# Altium schematic sheet I2C_Shield.SchDoc
size A4; Address1: Atakan
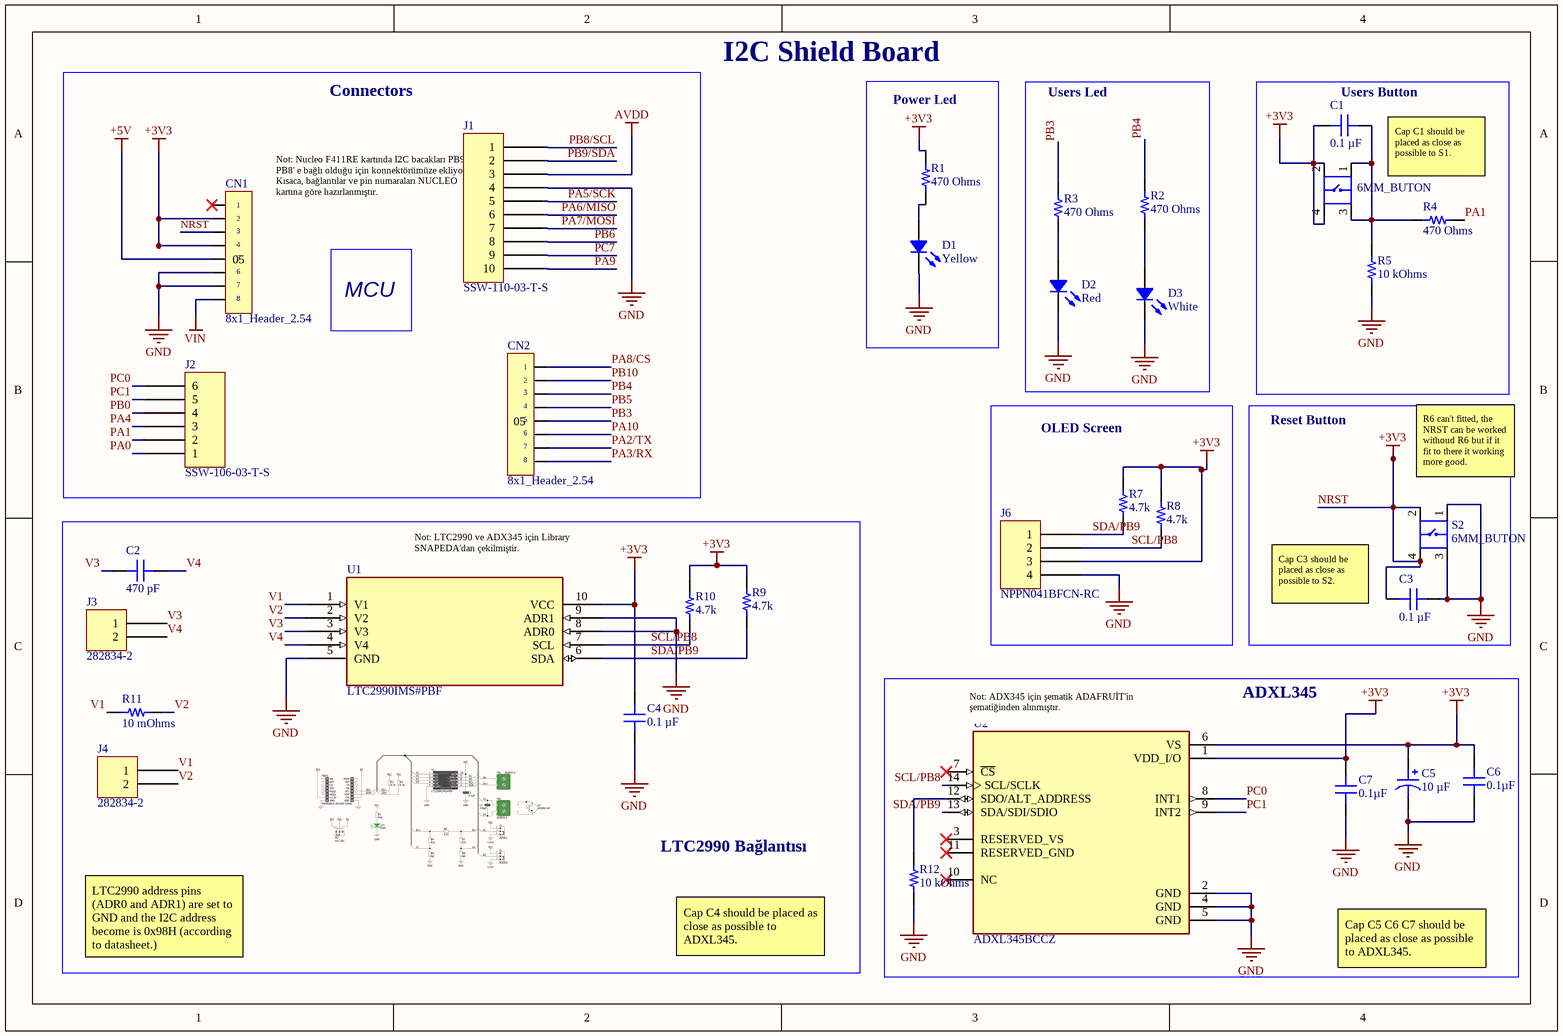
[diagram p0: I2C_Shield.SchDoc]

## Parts
C1  0.1 µF  [CAP 0805_2012]
C2  470 pF  [CAP 0805_2012]
C3  0.1 µF  [CAP 0805_2012]
C4  0.1 µF  [CAP 0805_2012]
C5  10 µF  [CAP POL 1206_3216]
C6  0.1µF  [CAP 0805_2012]
C7  0.1µF  [CAP 0805_2012]
CN1  8x1_Header_2.54  [8X1_HEADER]
CN2  8x1_Header_2.54  [8X1_HEADER]
D1  Yellow  [LED 0805_2012 YELLOW]
D2  Red  [LED 0805_2012 RED]
D3  White  [LED 0805_2012]
J1  SSW-110-03-T-S  [SAMTEC SSW-110-03-T-S]
J2  SSW-106-03-T-S  [SAMTEC SSW-106-03-T-S]
J3  282834-2  [TE 282834-2]
J4  282834-2  [TE 282834-2]
J6  NPPN041BFCN-RC  [SULLINS NPPN041BFCN]
R1  470 Ohms  [YAGEO RES RK73 RS73 SG73 0805_2012]
R2  470 Ohms  [YAGEO RES RK73 RS73 SG73 0805_2012]
R3  470 Ohms  [YAGEO RES RK73 RS73 SG73 0805_2012]
R4  470 Ohms  [YAGEO RES RK73 RS73 SG73 0805_2012]
R5  10 kOhms  [RES 0805_2012]
R7  4.7k  [RES 0805_2012]
R8  4.7k  [RES 0805_2012]
R9  4.7k  [RES 0805_2012]
R10  4.7k  [RES 0805_2012]
R11  10 mOhms  [RES 0805_2012]
R12  10 kOhms  [RES 0805_2012]
S1  6MM_BUTON  [6MMTACTILESWITCH]
S2  6MM_BUTON  [6MMTACTILESWITCH]
U1  LTC2990IMS#PBF  [MSOP-10_MS]
U2  ADXL345BCCZ  [IC_ADXL345BCCZ]

## Blocks framed on the sheet
MCU: CN1 CN2 J1 J2
Power Led: D1 R1
Users Led: D2 D3 R2 R3
Users Button: C1 R4 R5 S1
OLED Screen: J6 R7 R8
Reset Button: C3 S2
LTC2990 Bağlantısı: C2 C4 J3 J4 R9-R11 U1
ADXL345: C5-C7 R12 U2

## Nets
+5V: CN1.05
AVDD: J1.3
GND: C3.2 C4.2 C5.2 C6.2 C7.2 CN1.06 CN1.07 D1.2 D2.2 D3.2 J1.4 J6.4 R5.2 R12.2 S2.1 S2.3 U1.5(GND) U1.8(ADR0) U1.9(ADR1) U2.2(GND) U2.4(GND) U2.5(GND)
NRST: C1.1 C3.1 C4.1 C5.1 C6.1 C7.1 CN1.02 CN1.03 CN1.04 J6.3 R1.1 R7.1 R8.1 R9.1 R10.1 S1.2 S1.4 S2.2 S2.4 U1.10(VCC) U2.1(VDD_I/O) U2.6(VS)  [also labelled +3V3]
VIN: CN1.08
PA0: J2.1
PA1: J2.2 R4.1
PA2/TX: CN2.07
PA3/RX: CN2.08
PA4: J2.3
PA5/SCK: J1.5
PA6/MISO: J1.6
PA7/MOSI: J1.7
PA8/CS: CN2.01
PA9: J1.10
PA10: CN2.06
PB0: J2.4
PB3: CN2.05 R3.1
PB4: CN2.03 R2.1
PB5: CN2.04
PB6: J1.8
PB8/SCL: J1.1
PB9/SDA: J1.2
PB10: CN2.02
PC0: J2.6 U2.8(INT1)
PC1: J2.5 U2.9(INT2)
PC7: J1.9
SCL/PB8: J6.2 R8.2 R10.2 U1.7(SCL) U2.14(SCL/SCLK)
SDA/PB9: J6.1 R7.2 R9.2 U1.6(SDA) U2.13(SDA/SDI/SDIO)
V1: J4.1 R11.1 U1.1(V1)
V2: J4.2 R11.2 U1.2(V2)
V3: C2.1 J3.1 U1.3(V3)
V4: C2.2 J3.2 U1.4(V4)
NetC1_2: C1.2 R4.2 R5.1 S1.1 S1.3
NetD1_1: D1.1 R1.2
NetD2_1: D2.1 R3.2
NetD3_1: D3.1 R2.2
NetR12_1: R12.1 U2.12(SDO/ALT_ADDRESS)

Not connected (* = marked no-connect by the designer): CN1 01*; U2 3(RESERVED_VS)* 7(~{CS})* 10(NC)* 11(RESERVED_GND)*

## Notes on the sheet
- Connectors
- I2C Shield Board
- Cap C1 should be placed as close as possible to S1.
- (near J1) Not: Nucleo F411RE kartında I2C bacakları PB9 ve PB8' e bağlı olduğu için konnektörümüze ekliyoruz. Kısaca, bağlantılar ve pin numaraları NUCLEO kartına göre hazırlanmıştır.
- (near S2) R6 can't fitted, the NRST can be worked withoud R6 but if it fit to there it working more good.
- (near U1) Not: LTC2990 ve ADX345 için Library SNAPEDA'dan çekilmiştir.
- (near C3) Cap C3 should be placed as close as possible to S2.
- (near U2) Not: ADX345 için şematik ADAFRUİT'in şematiğinden alınmıştır.
- LTC2990 address pins (ADR0 and ADR1) are set to GND and the I2C address become is 0x98H (according to datasheet.)
- Cap C4 should be placed as close as possible to ADXL345.
- Cap C5 C6 C7 should be placed as close as possible to ADXL345.
- Title
- Size:
- Date:
- A4
- Number:
- Time:
- Revision:
- Sheet
- of
- File:
- (in symbol 8x1_Header_2.54) 1; 2; 3; 4; 5; 6; 7; 8

## Library data of the parts
C1 C3 = 0805B104K160CT: CAP CER 0.1UF 16V X7R 0805; manufacturer: Walsin Technology Corporation; Tolerance: ±10%; Part Number: 0805B104K160CT; Applications: General Purpose; componentlink1description: Datasheet; componentlink1url: http://www.passivecomponent.com/wp-content/uploads/2018/10/MLCC.pdf; componentlink2description: DigiKey Link; componentlink2url: https://www.digikey.com/en/products/detail/walsin-technology-corporation/0805B104K160CT/9355062; Device Package: 0805 (2012 Metric); lastupdated: 9.02.2024 20:16:02; Lifecycle Status: Active; Minimum Order: 1; Mounting Type: Surface Mount, MLCC; Operating Temperature: -55°C ~ 125°C; Package / Case: 0805 (2012 Metric); packaging: TapeAndReel; partid: 4882; Part Status: Active; price: 0.01; series: -; Size / Dimension: 0.079" L x 0.049" W (2.00mm x 1.25mm); Supplier 1: DigiKey; Supplier Part Number 1: 1292-1565-1-ND; Temperature Coefficient: X7R; Thickness (Max): 0.035" (0.90mm); value: 0.1 µF; Voltage - Rated: 16V
  C1: Capacitance: 0.1 µF
C2 = 885012207006: CAP CER 470PF 10V X7R 0805; manufacturer: Würth Elektronik; Tolerance: ±10%; Part Number: 885012207006; Capacitance: 470 pF; Applications: General Purpose; componentlink1description: Datasheet; componentlink1url: https://katalog.we-online.de/pbs/datasheet/885012207006.pdf; componentlink2description: DigiKey Link; componentlink2url: https://www.digikey.com/en/products/detail/würth-elektronik/885012207006/5453871; Device Package: 0805 (2012 Metric); lastupdated: 9.02.2024 20:15:30; Lifecycle Status: Active; Minimum Order: 1; Mounting Type: Surface Mount, MLCC; Operating Temperature: -55°C ~ 125°C; Package / Case: 0805 (2012 Metric); packaging: TapeAndReel; partid: 42624; Part Status: Active; price: 0.03; series: WCAP-CSGP; Size / Dimension: 0.079" L x 0.049" W (2.00mm x 1.25mm); Supplier 1: DigiKey; Supplier Part Number 1: 732-8016-1-ND; Temperature Coefficient: X7R; Thickness (Max): 0.035" (0.90mm); value: 470 pF; Voltage - Rated: 10V
C4 = LMK212SD104KG-T: CAP CER 0.1UF 10V 0805; manufacturer: Taiyo Yuden; Tolerance: ±10%; Part Number: LMK212SD104KG-T; Capacitance: 0.1 µF; Applications: General Purpose; componentlink1description: Datasheet; componentlink1url: http://www.yuden.co.jp/productdata/catalog/mlcc07_e.pdf; componentlink2description: DigiKey Link; componentlink2url: https://www.digikey.com/en/products/detail/taiyo-yuden/LMK212SD104KG-T/930486; Device Package: 0805 (2012 Metric); Features: Low Distortion; lastupdated: 9.02.2024 20:15:36; Lifecycle Status: Active; Minimum Order: 1; Mounting Type: Surface Mount, MLCC; Operating Temperature: -55°C ~ 125°C; Package / Case: 0805 (2012 Metric); packaging: TapeAndReel; partid: 14462; Part Status: Active; price: 0.06; series: CFCAP™; Size / Dimension: 0.079" L x 0.049" W (2.00mm x 1.25mm); Supplier 1: DigiKey; Supplier Part Number 1: 587-1134-1-ND; Thickness (Max): 0.053" (1.35mm); value: 0.1 µF; Voltage - Rated: 10V
C5 = 593D106X9010A2TE3: CAP TANT 10UF 10% 10V 1206; manufacturer: Vishay Sprague; Manufacturer Size Code: A; ESR (Equivalent Series Resistance): 2Ohm; Type: Molded; Part Number: 593D106X9010A2TE3; Value: 10 µF; Capacitance: 10 µF; componentlink1description: Datasheet; componentlink1url: http://www.vishay.com/docs/40005/593d.pdf; componentlink2description: DigiKey Link; componentlink2url: https://www.digikey.com/en/products/detail/vishay-sprague/593D106X9010A2TE3/1579064; Device Package: 1206 (3216 Metric); Features: General Purpose; Height - Seated (Max): 0.071" (1.80mm); lastupdated: 3.06.2024 19:29:35; Lifecycle Status: Active; Minimum Order: 1; Mounting Type: Surface Mount; Operating Temperature: -55°C ~ 125°C; Package / Case: 1206 (3216 Metric); packaging: TapeAndReel; partid: 896; Part Status: Active; price: 0.09; series: TANTAMOUNT™, 593D; Size / Dimension: 0.126" L x 0.063" W (3.20mm x 1.60mm); Supplier 1: DigiKey; Supplier Part Number 1: 718-1969-1-ND; Tolerance: ±10%; Voltage - Rated: 10 V
C6 C7 = 08053C104JAT4A: CAP CER 0.1UF 25V X7R 0805; manufacturer: AVX Corporation; Tolerance: ±5%; Part Number: 08053C104JAT4A; Capacitance: 0.1µF; Applications: General Purpose; componentlink1description: Datasheet; componentlink1url: http://datasheets.avx.com/X7RDielectric.pdf; componentlink2description: DigiKey Link; componentlink2url: http://digikey.com/product-detail/en/avx-corporation/08053C104JAT4A/478-13051-1-ND/9948569; Device Package: 0805 (2012 Metric); lastupdated: 2.09.2020 01:04:39; Lifecycle Status: Active; Minimum Order: 1; Mounting Type: Surface Mount, MLCC; Operating Temperature: -55°C ~ 125°C; Package / Case: 0805 (2012 Metric); packaging: TapeAndReel; partid: 3721; Part Status: Active; price: 0.04; series: -; Size / Dimension: 0.079" L x 0.049" W (2.01mm x 1.25mm); Supplier 1: DigiKey; Supplier Part Number 1: 478-13051-1-ND; Temperature Coefficient: X7R; Thickness (Max): 0.037" (0.94mm); value: 0.1µF; Voltage - Rated: 25V
D1 = 5975406507F: LED YELLOW 0805 SMD; Manufacturer: Dialight; Configuration: Standard; Current - Test: 20mA; Lens Color: 0.93mm; Lens Size: 1.40mm x 1.24mm; Lens Style: Rectangle with Flat Top; Millicandela Rating: 160mcd; Voltage - Forward (Vf) (Typ): 2V; Wavelength - Dominant: 590nm; Part Number: 5975406507F; Color: Yellow; ComponentLink1Description: Datasheet; ComponentLink1URL: http://www.dialightsignalsandcomponents.com/Assets/Drawings/2D_Drawings_DrawingDetailedSpec/NewDrawings/18370A.pdf; ComponentLink2Description: DigiKey Link; ComponentLink2URL: https://www.digikey.com/en/products/detail/dialight/5975406507F/9385442; Device Package: 0805 (2012 Metric); Height (Max): 0.93mm; LastUpdated: 3.06.2024 20:01:27; Lifecycle Status: Active; Minimum Order: 1; Mounting Type: Surface Mount; Package / Case: 0805 (2012 Metric); Packaging: TapeAndReel; PartId: 53; Part Status: Active; Price: 0.12; Series: 597; Size / Dimension: 2.00mm L x 1.25mm W; Supplier 1: DigiKey; Supplier Part Number 1: 350-4387-1-ND; Supplier Device Package: 0805; Value: Yellow
D2 = LS R976-NR-1: LED RED DIFFUSED 0805 SMD; Manufacturer: OSRAM Opto Semiconductors Inc.; Configuration: Standard; Current - Test: 20mA; Lens Color: White; Lens Size: 1.30mm x 1.25mm; Lens Style: Rectangle with Flat Top; Millicandela Rating: 104mcd; Viewing Angle: 160°; Voltage - Forward (Vf) (Typ): 2V; Wavelength - Dominant: 633nm; Wavelength - Peak: 645nm; Part Number: LS R976-NR-1; Color: Red; ComponentLink1Description: Datasheet; ComponentLink1URL: https://dammedia.osram.info/media/resource/hires/osram-dam-2493505/LS%20R976.pdf; ComponentLink2Description: DigiKey Link; ComponentLink2URL: https://www.digikey.com/en/products/detail/osram-opto-semiconductors-inc/LS-R976-NR-1/1227987; Device Package: 0805 (2012 Metric); Height (Max): 0.90mm; LastUpdated: 3.06.2024 20:00:06; Lens Transparency: Diffused; Lifecycle Status: Active; Minimum Order: 1; Mounting Type: Surface Mount; Package / Case: 0805 (2012 Metric); Packaging: TapeAndReel; PartId: 349; Part Status: Active; Price: 0.03; Series: CHIPLED 0805; Size / Dimension: 2.00mm L x 1.25mm W; Supplier 1: DigiKey; Supplier Part Number 1: 475-1278-1-ND; Supplier Device Package: 0805; Value: Red
D3 = B1701TX--20P000614U1930: LED WHITE 0805 SMD; Manufacturer: Harvatek Corporation; Current - Test: 20mA; Lens Color: Yellow; Lens Size: 1.40mm x 1.30mm; Lens Style: Rectangle with Flat Top; Millicandela Rating: 450mcd; Viewing Angle: 130°, 140°; Voltage - Forward (Vf) (Typ): 3.2V; Part Number: B1701TX--20P000614U1930; Color: White; ComponentLink1Description: Datasheet; ComponentLink1URL: https://media.digikey.com/pdf/Data%20Sheets/Harvatek%20PDFs/B1701TX--20P000614U1930.pdf; ComponentLink2Description: DigiKey Link; ComponentLink2URL: https://www.digikey.com/en/products/detail/harvatek-corporation/B1701TX-20P000614U1930/16671745; Device Package: 0805 (2012 Metric); Height (Max): 0.90mm; LastUpdated: 3.06.2024 20:04:49; Lifecycle Status: Active; Minimum Order: 1; Mounting Type: Surface Mount; Package / Case: 0805 (2012 Metric); Packaging: TapeAndReel; PartId: 1196; Part Status: Active; Price: 0.12; Series: B1701TX; Size / Dimension: 2.00mm L x 1.30mm W; Supplier 1: DigiKey; Supplier Part Number 1: 3147-B1701TX--20P000614U1930CT-ND; Supplier Device Package: 0805; Value: White
J1 = SSW-110-03-T-S: CONN RCPT 10POS 0.1 TIN PCB; Manufacturer: Samtec Inc.; Connector Type: Receptacle; Contact Length - Post: 0.394" (10.00mm); Current Rating (Amps): 5.7A per Contact; Material Flammability Rating: UL94 V-0; Number of Positions: 10; Number of Positions Loaded: All; Pitch - Mating: 0.100" (2.54mm); Style: Board to Board or Cable; Part Number: SSW-110-03-T-S; ComponentLink2Description: DigiKey Link; ComponentLink2URL: https://www.digikey.com/en/products/detail/samtec-inc/SSW-110-03-T-S/7877438; Contact Finish - Mating: Tin; Contact Finish - Post: Tin; Contact Type: Forked; Fastening Type: Push-Pull; Insulation Color: Black; Insulation Height: 0.335" (8.51mm); LastUpdated: 21.06.2022 15:10:16; Lifecycle Status: Active; Minimum Order: 1; Mounting Type: Through Hole; Number of Rows: 1; Operating Temperature: -55°C ~ 105°C; Packaging: Bulk; Part Status: Active; Price: 0.91; Series: SSW; Supplier 1: DigiKey; Supplier Part Number 1: SSW-110-03-T-S-ND; Termination: Solder
J2 = SSW-106-03-T-S: CONN RCPT 6POS 0.1 TIN PCB; Manufacturer: Samtec Inc.; Connector Type: Receptacle; Contact Length - Post: 0.394" (10.00mm); Current Rating (Amps): 5.7A per Contact; Material Flammability Rating: UL94 V-0; Number of Positions: 6; Number of Positions Loaded: All; Pitch - Mating: 0.100" (2.54mm); Style: Board to Board or Cable; Part Number: SSW-106-03-T-S; ComponentLink1Description: Datasheet; ComponentLink1URL: http://suddendocs.samtec.com/prints/ssw-s.pdf; ComponentLink2Description: DigiKey Link; ComponentLink2URL: https://www.digikey.com/en/products/detail/samtec-inc/SSW-106-03-T-S/1790202; Contact Finish - Mating: Tin; Contact Finish - Post: Tin; Contact Type: Forked; Fastening Type: Push-Pull; Insulation Color: Black; Insulation Height: 0.335" (8.51mm); LastUpdated: 21.06.2022 15:09:22; Lifecycle Status: Active; Minimum Order: 1; Mounting Type: Through Hole; Number of Rows: 1; Operating Temperature: -55°C ~ 105°C; Packaging: Bulk; Part Status: Active; Price: 0.55; Series: SSW; Supplier 1: DigiKey; Supplier Part Number 1: SAM8865-ND; Termination: Solder
J3 J4 = 282834-2: TERM BLK 2P SIDE ENT 2.54MM PCB; Manufacturer: TE Connectivity AMP Connectors; Current: 10A; Mating Orientation: Horizontal with Board; Number of Levels: 1; Pitch: 0.100" (2.54mm); Positions Per Level: 2; Voltage: 150V; Wire Gauge: 16-30 AWG; Wire Termination: Screw - Rising Cage Clamp; Part Number: 282834-2; Color: Green; ComponentLink1Description: Datasheet; ComponentLink1URL: https://www.te.com/commerce/DocumentDelivery/DDEController?Action=srchrtrv&DocNm=282834&DocType=Customer+Drawing&DocLang=English; ComponentLink2Description: DigiKey Link; ComponentLink2URL: http://digikey.com/product-detail/en/te-connectivity-amp-connectors/282834-2/A98333-ND/1150135; LastUpdated: 15.01.2020 04:15:38; Lifecycle Status: Active; Minimum Order: 1; Mounting Type: Through Hole; Packaging: Bulk; Part Status: Active; Price: 0.88; Series: Buchanan; Supplier 1: DigiKey; Supplier Part Number 1: A98333-ND
J6 = NPPN041BFCN-RC: CONN HDR 4POS 0.079 GOLD PCB; Manufacturer: Sullins Connector Solutions; Connector Type: Header; Contact Length - Post: 0.094" (2.40mm); Current Rating (Amps): 2A; Material Flammability Rating: UL94 V-0; Number of Positions: 4; Number of Positions Loaded: All; Pitch - Mating: 0.079" (2.00mm); Style: Board to Board; Part Number: NPPN041BFCN-RC; ComponentLink1Description: Datasheet; ComponentLink1URL: https://drawings-pdf.s3.amazonaws.com/10483.pdf; ComponentLink2Description: DigiKey Link; ComponentLink2URL: https://www.digikey.com/en/products/detail/sullins-connector-solutions/NPPN041BFCN-RC/804806; Contact Finish - Mating: Gold; Contact Finish - Post: Gold; Contact Finish Thickness - Mating: Flash; Contact Type: Female Socket; Fastening Type: Push-Pull; Insulation Color: Black; Insulation Height: 0.173" (4.40mm); LastUpdated: 21.06.2022 14:42:51; Lifecycle Status: Active; Minimum Order: 1; Mounting Type: Through Hole; Number of Rows: 1; Operating Temperature: -40°C ~ 105°C; Packaging: Tube; Part Status: Active; Price: 0.30; Series: -; Supplier 1: DigiKey; Supplier Part Number 1: S5751-04-ND; Termination: Solder
R1-R4 = RK73G2ARTTD4700D: RES 470 OHM 0.5% 1/8W 0805; Manufacturer: KOA Speer Electronics, Inc.; Power (Watts): 0.125W, 1/8W; Temperature Coefficient: ±50ppm/°C; Part Number: RK73G2ARTTD4700D; Value: 470 Ohms; ComponentLink1Description: Datasheet; ComponentLink1URL: https://www.koaspeer.com/pdfs/RK73G-RT.pdf; ComponentLink2Description: DigiKey Link; ComponentLink2URL: https://www.digikey.com/en/products/detail/koa-speer-electronics-inc/RK73G2ARTTD4700D/16968130; Composition: Thick Film; Device Package: 0805 (2012 Metric); Features: Anti-Sulfur, Automotive AEC-Q200; Height - Seated (Max): 0.024" (0.60mm); LastUpdated: 25.07.2024 09:45:10; Lifecycle Status: Active; Minimum Order: 1; Number of Terminations: 2; Operating Temperature: -55°C ~ 155°C; Package / Case: 0805 (2012 Metric); Packaging: TapeAndReel; PartId: 90317; Price: 0.04; Ratings: AEC-Q200; Resistance: 470 Ohms; Series: RK73G-RT; Size / Dimension: 0.079" L x 0.049" W (2.00mm x 1.25mm); Supplier 1: DigiKey; Supplier Part Number 1: 2019-RK73G2ARTTD4700DCT-ND; Supplier Device Package: 0805; Tolerance: ±0.5%
R5 R12 = RNCS0805BKE10K0: RES 10K OHM 0.1% 1/10W 0805; Manufacturer: Stackpole Electronics Inc; Power (Watts): 0.1W, 1/10W; Temperature Coefficient: ±25ppm/°C; Part Number: RNCS0805BKE10K0; Value: 10 kOhms; ComponentLink1Description: Datasheet; ComponentLink1URL: https://www.seielect.com/catalog/sei-rncs_rnch.pdf; ComponentLink2Description: DigiKey Link; ComponentLink2URL: https://www.digikey.com/en/products/detail/stackpole-electronics-inc/RNCS0805BKE10K0/1800067; Composition: Thin Film; Device Package: 0805 (2012 Metric); Features: Anti-Corrosive, Automotive AEC-Q200, Moisture Resistant; Height - Seated (Max): 0.026" (0.65mm); LastUpdated: 8.02.2024 21:02:39; Lifecycle Status: Active; Minimum Order: 1; Number of Terminations: 2; Operating Temperature: -55°C ~ 155°C; Package / Case: 0805 (2012 Metric); Packaging: TapeAndReel; PartId: 27713; Part Status: Active; Price: 0.07; Ratings: AEC-Q200; Resistance: 10 kOhms; Series: RNCS; Size / Dimension: 0.079" L x 0.049" W (2.00mm x 1.25mm); Supplier 1: DigiKey; Supplier Part Number 1: RNCS0805BKE10K0CT-ND; Supplier Device Package: 0805; Tolerance: ±0.1%
R7-R10 = RCS08054K70JNEA: RES SMD 4.7K OHM 5% 1/2W 0805; Manufacturer: Vishay Dale; Power (Watts): 0.5W, 1/2W; Resistance: 4.7 kOhms; Temperature Coefficient: ±200ppm/°C; Part Number: RCS08054K70JNEA; Value: 4.7k; ComponentLink1Description: Datasheet; ComponentLink1URL: http://www.vishay.com/docs/20065/rcse3.pdf; ComponentLink2Description: DigiKey Link; ComponentLink2URL: https://www.digikey.com/en/products/detail/vishay-dale/RCS08054K70JNEA/5867012; Composition: Thick Film; Device Package: 0805 (2012 Metric); Features: Automotive AEC-Q200, Pulse Withstanding; Height - Seated (Max): 0.020" (0.50mm); LastUpdated: 8.02.2024 21:02:38; Lifecycle Status: Active; Minimum Order: 1; Number of Terminations: 2; Operating Temperature: -55°C ~ 155°C; Package / Case: 0805 (2012 Metric); Packaging: TapeAndReel; PartId: 27839; Part Status: Active; Price: 0.02; Ratings: AEC-Q200; Series: RCS e3; Size / Dimension: 0.079" L x 0.049" W (2.00mm x 1.25mm); Supplier 1: DigiKey; Supplier Part Number 1: 541-2866-1-ND; Supplier Device Package: 0805; Tolerance: ±5%
R11 = CSRF0805FT10L0: RES 0.01 OHM 1% 1/2W 0805; Manufacturer: Stackpole Electronics Inc; Power (Watts): 0.5W, 1/2W; Temperature Coefficient: ±100ppm/°C; Part Number: CSRF0805FT10L0; Value: 10 mOhms; ComponentLink1Description: Datasheet; ComponentLink1URL: https://www.seielect.com/catalog/sei-csrf.pdf; ComponentLink2Description: DigiKey Link; ComponentLink2URL: https://www.digikey.com/en/products/detail/stackpole-electronics-inc/CSRF0805FT10L0/3477081; Composition: Metal Foil; Device Package: 0805 (2012 Metric); Features: Automotive AEC-Q200, Current Sense, Moisture Resistant; Height - Seated (Max): 0.033" (0.85mm); LastUpdated: 8.02.2024 21:02:35; Lifecycle Status: Active; Minimum Order: 1; Number of Terminations: 2; Operating Temperature: -55°C ~ 170°C; Package / Case: 0805 (2012 Metric); Packaging: TapeAndReel; PartId: 28462; Part Status: Active; Price: 0.12; Ratings: AEC-Q200; Resistance: 10 mOhms; Series: CSRF; Size / Dimension: 0.079" L x 0.049" W (2.00mm x 1.25mm); Supplier 1: DigiKey; Supplier Part Number 1: CSRF0805FT10L0CT-ND; Supplier Device Package: 0805; Tolerance: ±1%
S1 S2 = 6MM_BUTON: SWITCH TACT 6x6MM; Current: 50mA; Voltage Rate: 12V; Link: https://ozdisan.com/elektromekanik-komponentler/sivicler-ve-anahtarlar/tact-sivicler/DS1042-03-116-KKR-250-10/586990; Package Size: 6x6mm
U1 = LTC2990IMS#PBF: Quad I2C Voltage, Current and Temperature Monitor; MF: Analog Devices; Package: MSOP-10 Analog Devices; Price: None; Check_prices: https://www.snapeda.com/parts/LTC2990IMS%23PBF/Analog+Devices/view-part/?ref=eda; Value: *; SnapEDA_Link: https://www.snapeda.com/parts/LTC2990IMS%23PBF/Analog+Devices/view-part/?ref=snap; MP: LTC2990IMS#PBF; Availability: In Stock; Purchase-URL: https://pricing.snapeda.com/search?q=LTC2990IMS#PBF&ref=eda
U2 = ADXL345BCCZ: 3-Axis, Â±2 g/Â±4 g/Â±8 g/Â±16 g Digital Accelerometer; MF: Analog Devices; SnapEDA_Link: https://www.snapeda.com/parts/ADXL345BCCZ/Analog+Devices/view-part/?ref=snap; Package: LGA -14 Analog Devices; Value: *; MP: ADXL345BCCZ; Check_prices: https://www.snapeda.com/parts/ADXL345BCCZ/Analog+Devices/view-part/?ref=eda